# Altium project Power.PrjPcb
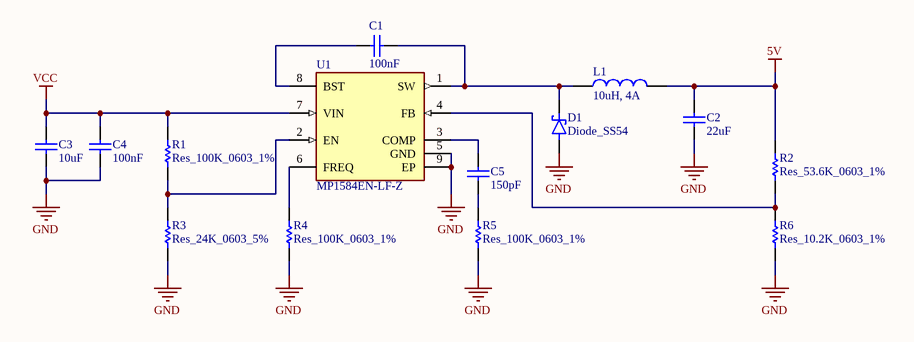
[diagram p0: Sheet1.SchDoc]
1 sheet, 14 parts. Net scope: global (net labels, ports and power ports of the same name join across sheets).
Board file: PCB1.PcbDoc

## Sheet Sheet1.SchDoc
size A; SheetNumber: 1; SheetTotal: 1

### Parts
C1  100nF  [CAP_0603]
C2  22uF  [CAP_0805]
C3  10uF  [CAP_0805]
C4  100nF  [CAP_0603]
C5  150pF  [CAP_0603]
D1  Diode_SS54  [D_SMA]
L1  10uH, 4A  [Inductor_0630]
R1  Res_100K_0603_1%  [Resistor_0603]
R2  Res_53.6K_0603_1%  [Resistor_0603]
R3  Res_24K_0603_5%  [Resistor_0603]
R4  Res_100K_0603_1%  [Resistor_0603]
R5  Res_100K_0603_1%  [Resistor_0603]
R6  Res_10.2K_0603_1%  [Resistor_0603]
U1  MP1584EN-LF-Z  [SOIC-8]

### Nets
5V: C2.2 L1.2 R2.2
GND: C2.1 C3.1 C4.1 D1.2(A) R3.1 R4.1 R5.1 R6.1 U1.5(GND) U1.9(EP)
VCC: C3.2 C4.2 R1.2 U1.7(VIN)
NetC1_1: C1.1 U1.8(BST)
NetC1_2: C1.2 D1.1(C) L1.1 U1.1(SW)
NetC5_1: C5.1 R5.2
NetC5_2: C5.2 U1.3(COMP)
NetR1_1: R1.1 R3.2 U1.2(EN)
NetR2_1: R2.1 R6.2 U1.4(FB)
NetR4_2: R4.2 U1.6(FREQ)

### Library data of the parts
C1 C4 = Ceramic_Cap_100nF_0603: CAP, size 0603, 100nF, 50V; Supply Part Number: Tụ Gốm 0603 100nF (0.1uF) 25V; Supply Name: Thegioiic; Datasheet: *; Supply URL: https://www.thegioiic.com/tu-gom-0603-100nf-0-1uf-25v
C2 = Ceramic_Cap_22uF_0805: CAP, size 0805, 22uF, 6.3V; Supply Part Number: Tụ Gốm 0805 22uF 6.3V; Supply Name: Thegioiic; Datasheet: *; Supply URL: https://www.thegioiic.com/tu-gom-0805-22uf-6-3v
C3 = Ceramic_Cap_10uF_0805: CAP, size 0805, 10uF, 50V; Supply Part Number: Tụ Gốm 0805 10uF 50V; Supply Name: Thegioiic; Datasheet: *; Supply URL: https://www.thegioiic.com/tu-gom-0805-10uf-50v
C5 = Ceramic_Cap_150pF_0603: CAP, size 0603, 150pF, 50V; Supply Part Number: Tụ Gốm 0603 150pF 50V; Supply Name: Thegioiic; Datasheet: *; Supply URL: https://www.thegioiic.com/tu-gom-0603-150pf-50v
D1 = Diode_SS54: Diode Schottky 40V 5A Surface Mount SMA; Supply Part Number: SS54 SMA Diode Shotky 5A 40V; Supply Name: Thegioiic; Datasheet: https://www.thegioiic.com/upload/documents/dc8a63b3eda4738bc390d9dc570a4e18.pdf; Supply URL: https://www.thegioiic.com/ss54-sma-diode-shotky-5a-40v
L1 = IND_10uH_0630: 10uH, 4A, Size 0630; Supply Part Number: Cuộn cảm 10UH 0630; Supply Name: icdayroi; Supply URL: https://icdayroi.com/cuon-cam-10uh-0630
R1 R4 R5 = Res_100K_0603_1%: Resistor 0603 100KOhm 1% 1_10W; Supply Part Number: Điện Trở 100 KOhm 0603 1%; Supply Name: Thegioiic; Supply URL: https://www.thegioiic.com/dien-tro-100-kohm-0603-1-
R2 = Res_53.6K_0603_1%: Resistor 0603 53.6KOhm 1% 1_10W; Supply Part Number: Điện Trở 53.6 KOhm 0603 1%; Supply Name: Thegioiic; Supply URL: https://www.thegioiic.com/dien-tro-53-6-kohm-0603-1-
R3 = Res_24K_0603_5%: Resistor 0603 24KOhm 5% 1_10W; Supply Part Number: Điện Trở 24 KOhm 0603 5%; Supply Name: Thegioiic; Supply URL: https://www.thegioiic.com/dien-tro-24-kohm-0603-5-
R6 = Res_10.2K_0603_1%: Resistor 0603 10.2KOhm 1% 1_10W; Supply Part Number: Điện Trở 10.2 KOhm 0603 1%; Supply Name: Thegioiic; Supply URL: https://www.thegioiic.com/dien-tro-10-2-kohm-0603-1-
U1 = MP1584EN-LF-Z: Buck Switching Regulator IC Positive Adjustable 0.8V 1 Output 3A 8-SOIC _0.154, 3.90mm Width_ Exposed Pad; Supply Name: tme; Datasheet: https://www.monolithicpower.com/en/documentview/productdocument/index/version/2/document_type/Datasheet/lang/en/sku/MP1584EN-LF-Z/document_id/204/?srsltid=AfmBOopCyUDyOs-uLll4YtNPir4o4STehG4B04EkgGGTflYW96m-OPS4; Supply Part Number: MP1584EN-LF-Z; Supply URL: http://www.tme.vn/Product.aspx?id=2070#page=pro_info